# EAGLE schematic FuzzFactoryPSJoy (EAGLE 9.5.2)
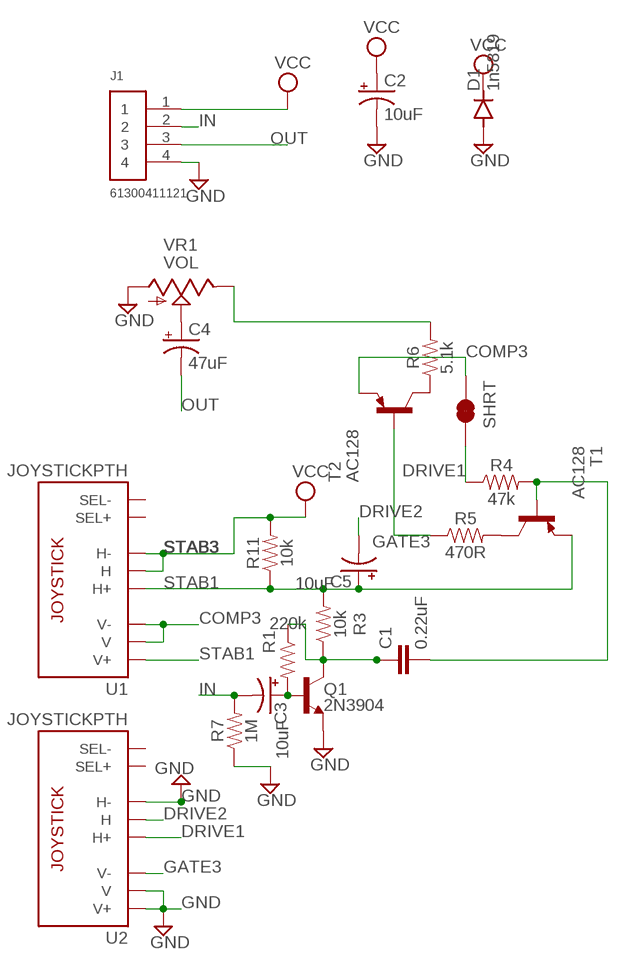
[diagram p0: schematic, sheet 1]

## Parts
C1  0.22uF  0.22UF-0603-25V-10%  [0603]
C2  10uF  CAP_SMD+THRUPAN_B  [PAN_B_SMD+THRU]
C3  10uF  CAP_SMD+THRUPAN_B  [PAN_B_SMD+THRU]
C4  47uF  CAP_SMD+THRUPAN_B  [PAN_B_SMD+THRU]
C5  10uF  CAP_SMD+THRUPAN_B  [PAN_B_SMD+THRU]
D1  1n5819  DIODE-SOD123  [SOD123]
J1  61300411121  [61300411121]
JP1  SHRT  JUMPER-SMT_2_NC_TRACE_NO-SILK  [SMT-JUMPER_2_NC_TRACE_NO-SILK]
Q1  2N3904  TRANS_NPN-MMBTA42  [SOT23-3]
R1  220k  220KOHM-0603-1/10W-1%  [0603]
R3  10k  10KOHM-0603-1/10W-1%  [0603]
R4  47k  47KOHM-0603-1/10W-1%  [0603]
R5  470R  RESISTOR0603  [0603]
R6  5.1k  RESISTOR0603  [0603]
R7  1M  1MOHM-0603-1/4W-5%  [0603]
R11  10k  10KOHM-0603-1/10W-1%  [0603]
T1  AC128  [TO18]
T2  AC128  [TO18]
U1  JOYSTICKPTH  [JOYSTICK]
U2  JOYSTICKPTH  [JOYSTICK]
VR1  VOL  9MM_SNAP-IN_POT_  [9MM_SNAP-IN_POT]

## Nets
COMP3: JP1.2 T2.1(E) U1.V2(V) U1.V3(V-)
DRIVE1: JP1.1 R4.1 U2.H1(H+)
DRIVE2: C5.- C5.--(-) U2.H2(H)
GATE3: R5.1 T2.2(B) U2.V3(V-)
GND: C2.- C2.--(-) D1.A J1.4 Q1.2(E) R7.1 U2.H3(H-) U2.V1(V+) U2.V2(V) VR1.1(A)
IN: C3.- C3.--(-) J1.2 R7.2
N$1: C1.1 Q1.3(C) R1.1 R3.1
N$2: C3.+ C3.++(+) Q1.1(B) R1.2
N$3: C1.2 R4.2 T1.2(B)
N$4: R5.2 T1.3(C)
N$5: C4.+ C4.++(+) VR1.2(S)
N$7: R6.1 T2.3(C)
N$8: R6.2 VR1.3(E)
OUT: C4.- C4.--(-) J1.3
STAB1: C5.+ C5.++(+) R3.2 R11.1 T1.1(E) U1.H1(H+) U1.V1(V+)
STAB3: R11.2 U1.H2(H) U1.H3(H-) ; supply symbol labelled VCC
VCC: C2.+ C2.++(+) D1.C J1.1
Unconnected: U1.B1A(SEL+) U1.B2A(SEL-) U2.B1A(SEL+) U2.B2A(SEL-)

## Library data of the parts
C1 = SparkFun-Capacitors:0.22UF: 0.22µF ceramic capacitors A capacitor is a passive two-terminal electrical component used to store electrical energy temporarily in an electric field.; PROD_ID: CAP-07822
C2-C5 = MusicThingModular:CAP_SMD+THRU
D1 = diode:DIODE-: DIODE
J1 = Headers:61300411121: CONN HEADER VERT 4POS 2.54MM Manufacturer's datasheet <https://katalog.we-online.de/em/datasheet/6130xx11121.pdf>; CREATED_BY: PCBLayout.com; DIGI_KEY_PART_NUMBER: 732-5317-ND; MANUFACTURER: Wurth Electronics Inc.; MPN: 61300411121
JP1 = SparkFun-Jumpers:JUMPER-SMT_2_NC_TRACE: Normally closed trace jumper This jumper has a trace between two pads so it's normally closed (NC). Use a razor knife to open the connection. For best results follow the IPC guidelines for cutting traces: Cutout at least 0.063 mm (0.005 in). Remove all loose material to clean up the cut area. Seal the cut with an approved epoxy. Reapply solder to reclose the connection.
Q1 = SparkFun-DiscreteSemi:TRANS_NPN: NPN transistor Current controlled devices typically used to amplify current or used as a switch. BC547 - COM-08928 <http://www.sparkfun.com/products/8928> (TO-92 45V 100mA) (1.Collector 2.Base 3.Emitter) 2N3904 - COM-00521 <http://www.sparkfun.com/products/521> (TO-92 40V 200mA) (1.Emitter 2.Base 3.Collector) P2N2222A - COM-12852 <http://www.sparkfun.com/products/12852> (TO-92 40V 600mA) (1.Collector 2.Base 3.Emitter); PROD_ID: TRANS-09116; VALUE: 500mA/300V
R1 = SparkFun-Resistors:220KOHM: 220kΩ resistor A resistor is a passive two-terminal electrical component that implements electrical resistance as a circuit element. Resistors act to reduce current flow, and, at the same time, act to lower voltage levels within circuits. - Wikipedia; PROD_ID: RES-08969
R3 R11 = SparkFun-Resistors:10KOHM: 10kΩ resistor A resistor is a passive two-terminal electrical component that implements electrical resistance as a circuit element. Resistors act to reduce current flow, and, at the same time, act to lower voltage levels within circuits. - Wikipedia; PROD_ID: RES-00824
R4 = SparkFun-Resistors:47KOHM: 47kΩ resistor A resistor is a passive two-terminal electrical component that implements electrical resistance as a circuit element. Resistors act to reduce current flow, and, at the same time, act to lower voltage levels within circuits. - Wikipedia; PROD_ID: RES-07871
R5 R6 = SparkFun-Resistors:RESISTOR: Generic Resistor Package
R7 = SparkFun-Resistors:1MOHM: 1MΩ resistor A resistor is a passive two-terminal electrical component that implements electrical resistance as a circuit element. Resistors act to reduce current flow, and, at the same time, act to lower voltage levels within circuits. - Wikipedia; PROD_ID: RES-07868
T1 T2 = AC128:AC128: PNP TRANSISTOR; AVAILABILITY: Unavailable; DESCRIPTION: IC DAC SEISMIC MON 24BIT 24TSSOP; MF: Nexperia USA; MP: AC128; PACKAGE: TSSOP-14 Nexperia USA; PRICE: None
U1 U2 = SparkFun-Electromechanical:JOYSTICK: Thumb Joystick Joystick commonly found in PS2 controllers. Two pots and a select switch. Footprint proven. Spark Fun Electronics SKU : COM-09032
VR1 = MusicThingModular:9MM_SNAP-IN_POT: 9mm vertical snap-in pot, Alpha / Panasonic style